# EAGLE design IPSv2.1 (EAGLE 9.5.1)

## Sheet 1 of 3: Circuit principal
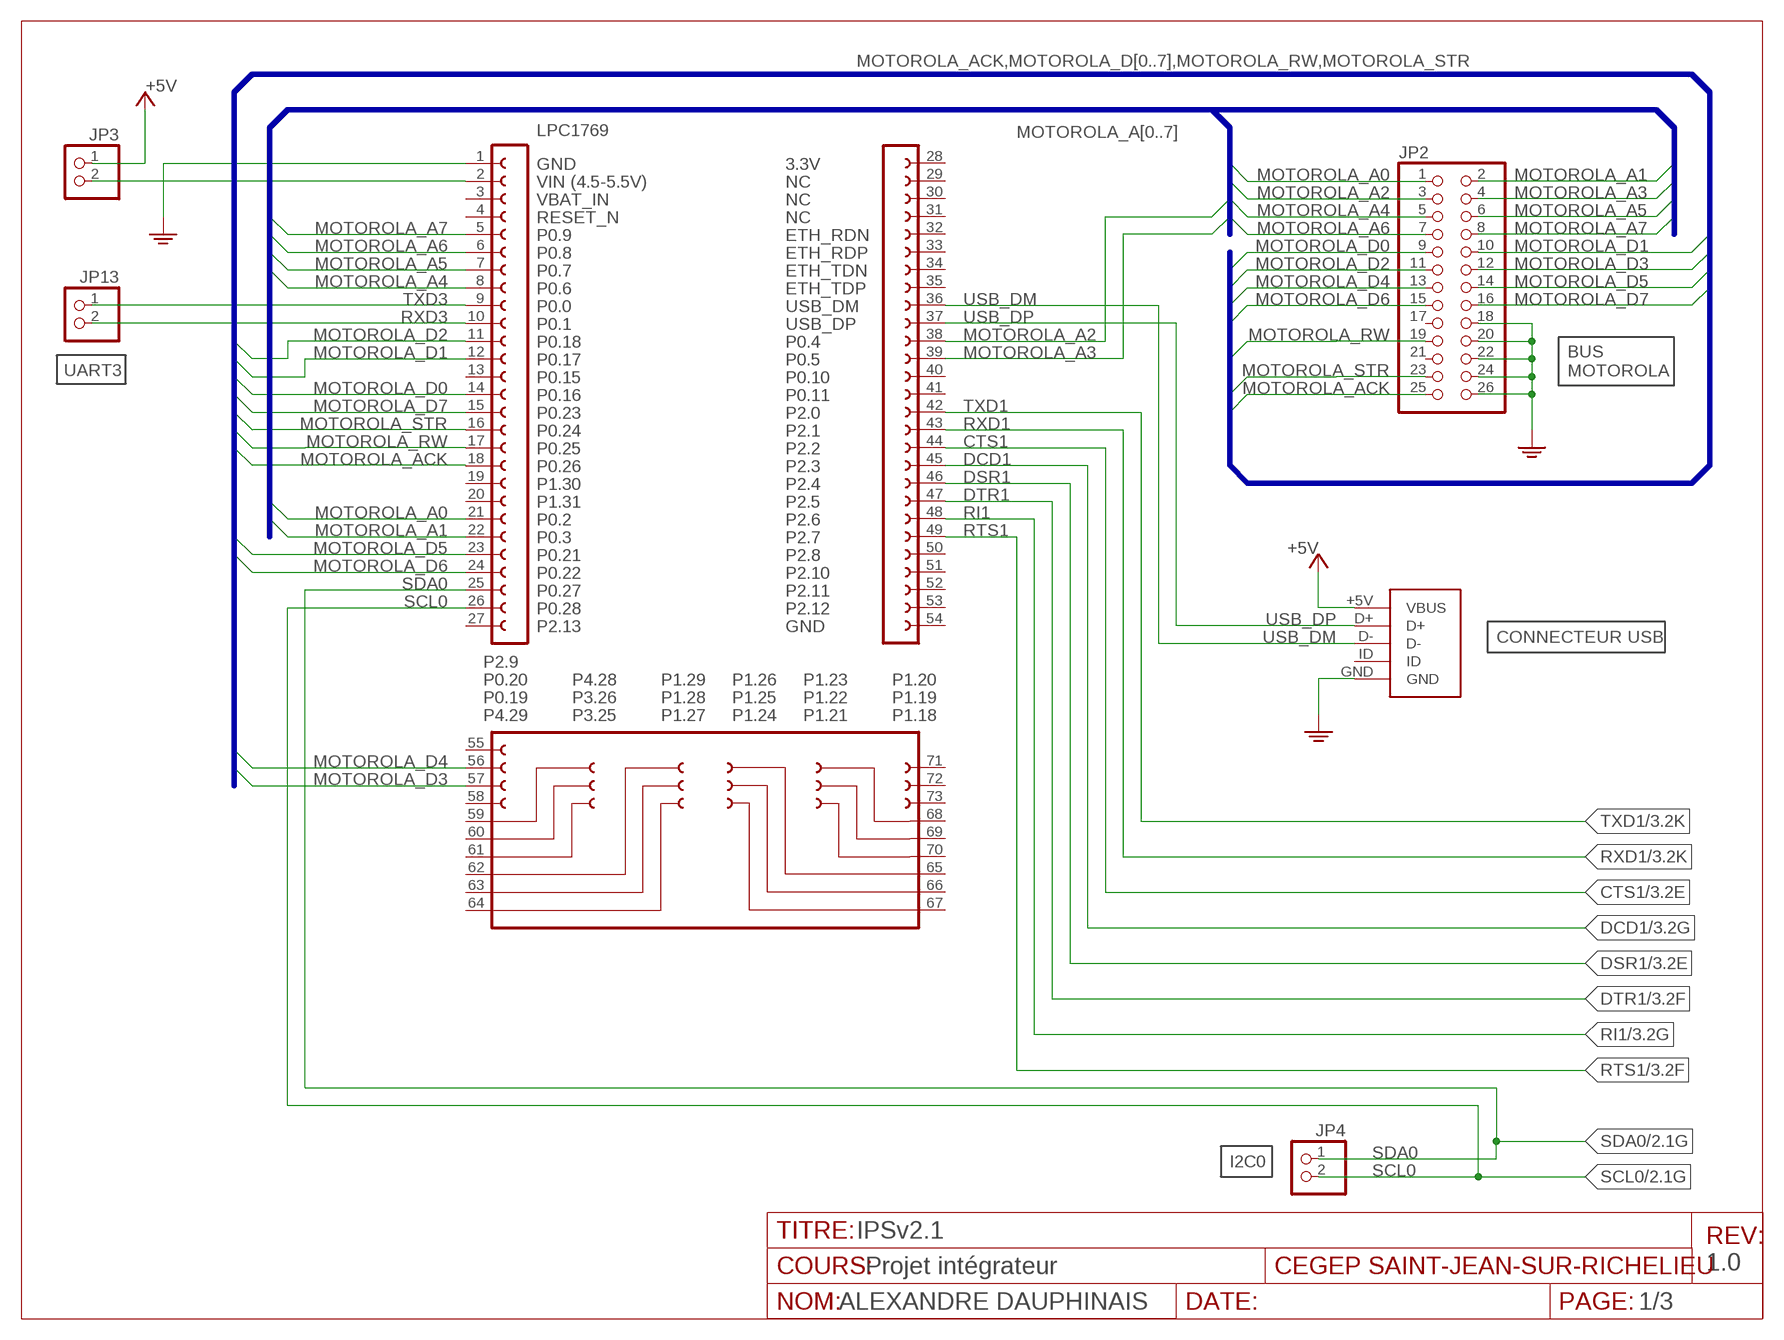
[diagram p0: schematic, sheet 1]

### Parts
JP2  PINHD-2X13  [2X13]
JP3  PINHD-1X2  [1X02]
JP4  PINHD-1X2  [1X02]
JP13  PINHD-1X2  [1X02]
LPC1769  LPCXPRESSO_LPC1769  [LPCXPRESSO_LPC1769]
U$2  USB-MICRO-BREAKOUT  [USB-MICRO-BREAKOUT]

### Nets
+5V: JP3.1 U$2.+5V(VBUS) ; also sheet 2,3
CTS1: LPC1769.44 ; also sheet 3
DCD1: LPC1769.45 ; also sheet 3
DSR1: LPC1769.46 ; also sheet 3
DTR1: LPC1769.47 ; also sheet 3
GND: JP2.18 JP2.20 JP2.22 JP2.24 JP2.26 LPC1769.1 U$2.GND ; also sheet 2,3
MOTOROLA_A0: JP2.1 LPC1769.21
MOTOROLA_A1: JP2.2 LPC1769.22
MOTOROLA_A2: JP2.3 LPC1769.38
MOTOROLA_A3: JP2.4 LPC1769.39
MOTOROLA_A4: JP2.5 LPC1769.8
MOTOROLA_A5: JP2.6 LPC1769.7
MOTOROLA_A6: JP2.7 LPC1769.6
MOTOROLA_A7: JP2.8 LPC1769.5
MOTOROLA_ACK: JP2.25 LPC1769.18
MOTOROLA_D0: JP2.9 LPC1769.14
MOTOROLA_D1: JP2.10 LPC1769.12
MOTOROLA_D2: JP2.11 LPC1769.11
MOTOROLA_D3: JP2.12 LPC1769.57
MOTOROLA_D4: JP2.13 LPC1769.56
MOTOROLA_D5: JP2.14 LPC1769.23
MOTOROLA_D6: JP2.15 LPC1769.24
MOTOROLA_D7: JP2.16 LPC1769.15
MOTOROLA_RW: JP2.19 LPC1769.17
MOTOROLA_STR: JP2.23 LPC1769.16
N$7: JP3.2 LPC1769.2
RI1: LPC1769.48 ; also sheet 3
RTS1: LPC1769.49 ; also sheet 3
RXD1: LPC1769.43 ; also sheet 3
RXD3: JP13.2 LPC1769.10
SCL0: JP4.2 LPC1769.26 ; also sheet 2
SDA0: JP4.1 LPC1769.25 ; also sheet 2
TXD1: LPC1769.42 ; also sheet 3
TXD3: JP13.1 LPC1769.9
USB_DM: LPC1769.36 U$2.D-
USB_DP: LPC1769.37 U$2.D+
Unconnected: JP2.17 JP2.21 LPC1769.3 LPC1769.4 LPC1769.13 LPC1769.19 LPC1769.20 LPC1769.27 LPC1769.28 LPC1769.29 LPC1769.30 LPC1769.31 LPC1769.32 LPC1769.33 LPC1769.34 LPC1769.35 LPC1769.40 LPC1769.41 LPC1769.50 LPC1769.51 LPC1769.52 LPC1769.53 LPC1769.54 LPC1769.55 LPC1769.58 LPC1769.59 LPC1769.60 LPC1769.61 LPC1769.62 LPC1769.63 LPC1769.64 LPC1769.65 LPC1769.66 LPC1769.67 LPC1769.68 LPC1769.69 LPC1769.70 LPC1769.71 LPC1769.72 LPC1769.73 U$2.ID

### Buses
MOTOROLA_A[0..7]
MOTOROLA_ACK,MOTOROLA_D[0..7],MOTOROLA_RW,MOTOROLA_STR

### Notes on the sheet
- UART3
- BUS
  MOTOROLA
- CONNECTEUR USB
- I2C0
- Projet intégrateur

## Sheet 2 of 3: I2C0
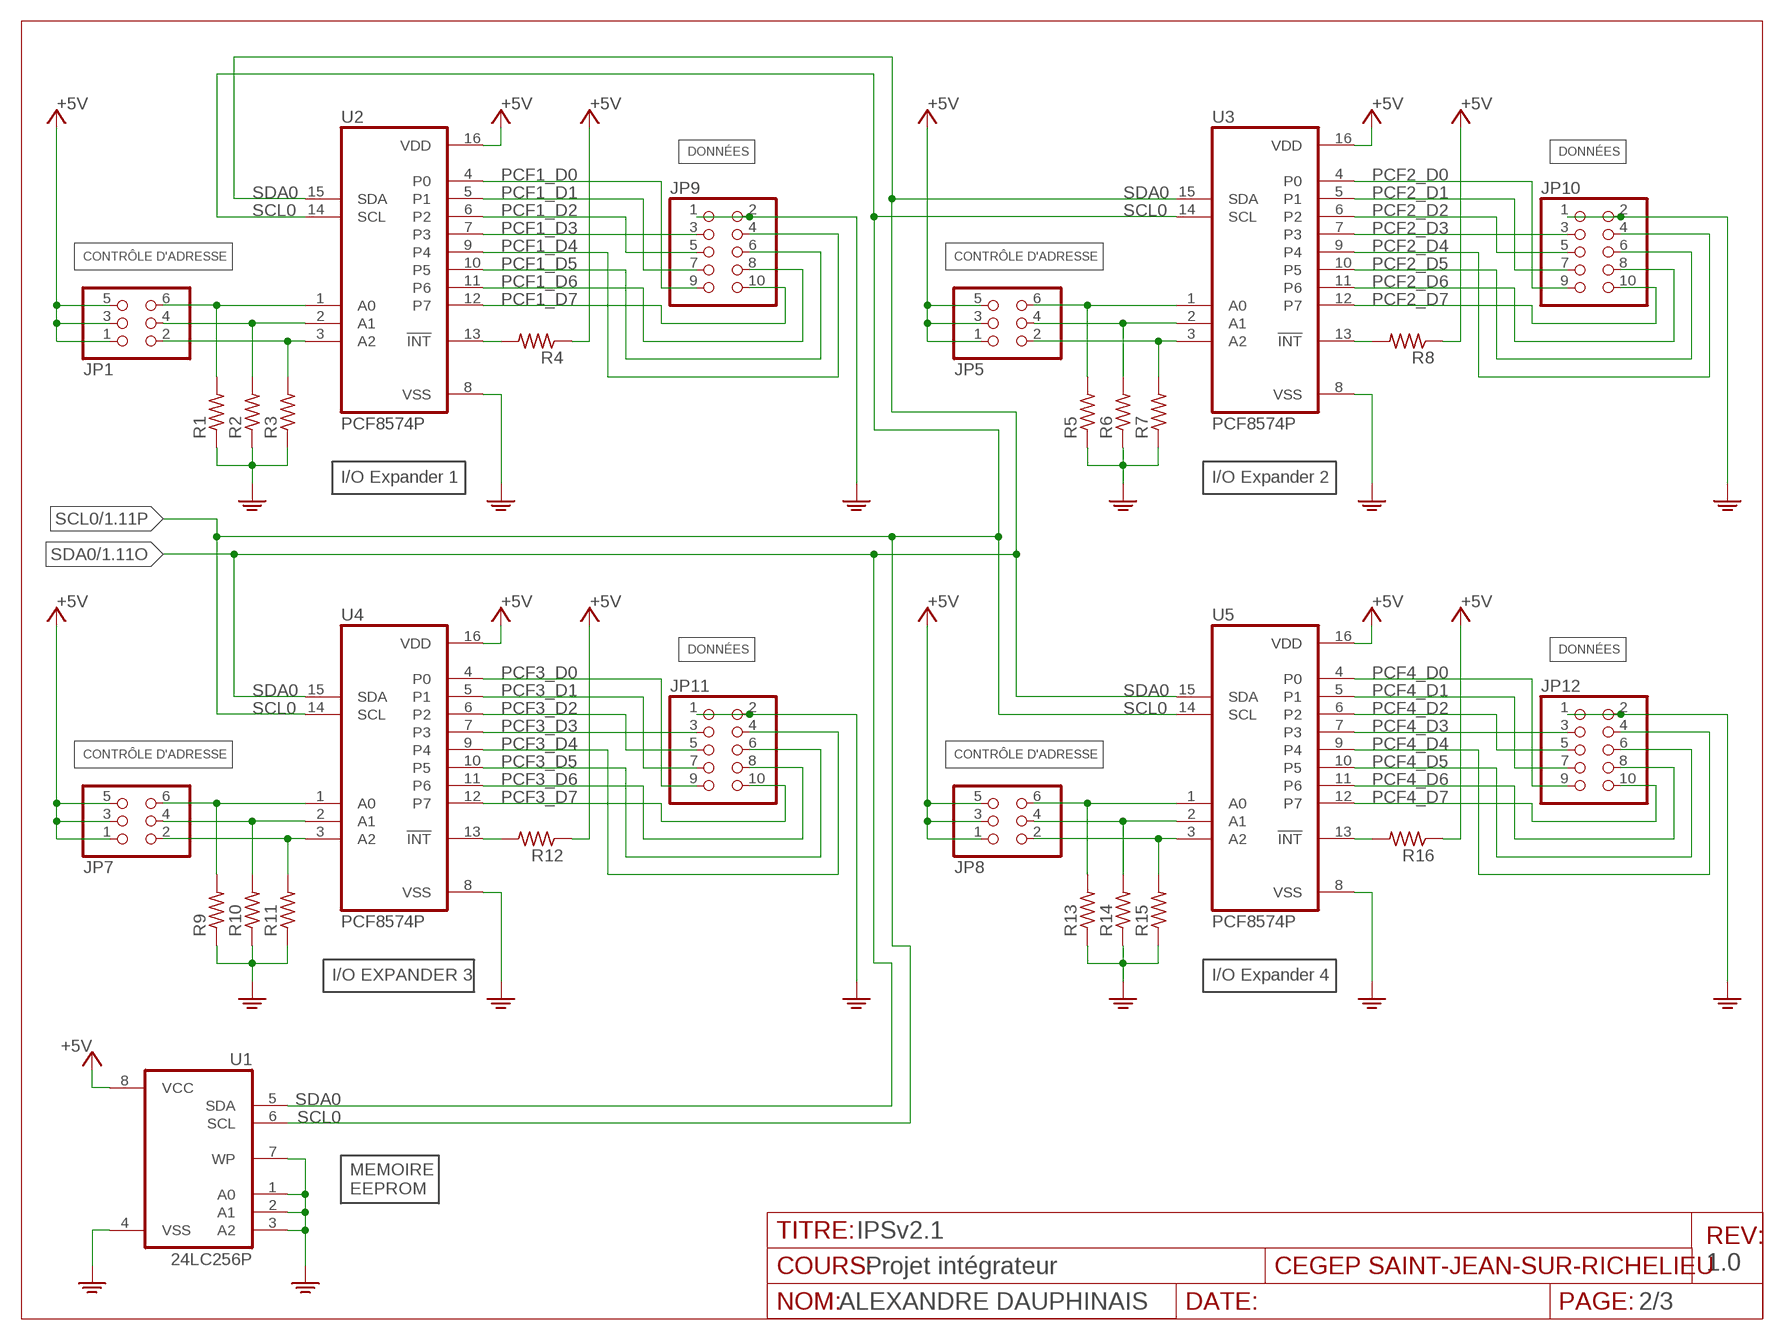
[diagram p1: schematic, sheet 2]

### Parts
JP1  PINHD-2X3  [2X03]
JP5  PINHD-2X3  [2X03]
JP7  PINHD-2X3  [2X03]
JP8  PINHD-2X3  [2X03]
JP9  PINHD-2X5  [2X05]
JP10  PINHD-2X5  [2X05]
JP11  PINHD-2X5  [2X05]
JP12  PINHD-2X5  [2X05]
R1  R-US_M1206  [M1206]
R2  R-US_M1206  [M1206]
R3  R-US_M1206  [M1206]
R4  R-US_M1206  [M1206]
R5  R-US_M1206  [M1206]
R6  R-US_M1206  [M1206]
R7  R-US_M1206  [M1206]
R8  R-US_M1206  [M1206]
R9  R-US_M1206  [M1206]
R10  R-US_M1206  [M1206]
R11  R-US_M1206  [M1206]
R12  R-US_M1206  [M1206]
R13  R-US_M1206  [M1206]
R14  R-US_M1206  [M1206]
R15  R-US_M1206  [M1206]
R16  R-US_M1206  [M1206]
U1  24LC256P  [DIP08]
U2  PCF8574P  [DIP16]
U3  PCF8574P  [DIP16]
U4  PCF8574P  [DIP16]
U5  PCF8574P  [DIP16]

### Nets
+5V: JP1.1 JP1.3 JP1.5 JP5.1 JP5.3 JP5.5 JP7.1 JP7.3 JP7.5 JP8.1 JP8.3 JP8.5 R4.1 R8.1 R12.1 R16.1 U1.8(VCC) U2.16(VDD) U3.16(VDD) U4.16(VDD) U5.16(VDD) ; also sheet 1,3
GND: JP9.1 JP9.2 JP10.1 JP10.2 JP11.1 JP11.2 JP12.1 JP12.2 R1.1 R2.1 R3.1 R5.1 R6.1 R7.1 R9.1 R10.1 R11.1 R13.1 R14.1 R15.1 U1.1(A0) U1.2(A1) U1.3(A2) U1.4(VSS) U1.7(WP) U2.8(VSS) U3.8(VSS) U4.8(VSS) U5.8(VSS) ; also sheet 1,3
N$1: R8.2 U3.13(!INT)
N$3: R12.2 U4.13(!INT)
N$4: R4.2 U2.13(!INT)
N$8: R16.2 U5.13(!INT)
PCF1_A0: JP1.6 R1.2 U2.1(A0)
PCF1_A1: JP1.4 R2.2 U2.2(A1)
PCF1_A2: JP1.2 R3.2 U2.3(A2)
PCF1_D0: JP9.9 U2.4(P0)
PCF1_D1: JP9.7 U2.5(P1)
PCF1_D2: JP9.5 U2.6(P2)
PCF1_D3: JP9.3 U2.7(P3)
PCF1_D4: JP9.4 U2.9(P4)
PCF1_D5: JP9.6 U2.10(P5)
PCF1_D6: JP9.8 U2.11(P6)
PCF1_D7: JP9.10 U2.12(P7)
PCF2_A0: JP5.6 R5.2 U3.1(A0)
PCF2_A1: JP5.4 R6.2 U3.2(A1)
PCF2_A2: JP5.2 R7.2 U3.3(A2)
PCF2_D0: JP10.9 U3.4(P0)
PCF2_D1: JP10.7 U3.5(P1)
PCF2_D2: JP10.5 U3.6(P2)
PCF2_D3: JP10.3 U3.7(P3)
PCF2_D4: JP10.4 U3.9(P4)
PCF2_D5: JP10.6 U3.10(P5)
PCF2_D6: JP10.8 U3.11(P6)
PCF2_D7: JP10.10 U3.12(P7)
PCF3_A0: JP7.6 R9.2 U4.1(A0)
PCF3_A1: JP7.4 R10.2 U4.2(A1)
PCF3_A2: JP7.2 R11.2 U4.3(A2)
PCF3_D0: JP11.9 U4.4(P0)
PCF3_D1: JP11.7 U4.5(P1)
PCF3_D2: JP11.5 U4.6(P2)
PCF3_D3: JP11.3 U4.7(P3)
PCF3_D4: JP11.4 U4.9(P4)
PCF3_D5: JP11.6 U4.10(P5)
PCF3_D6: JP11.8 U4.11(P6)
PCF3_D7: JP11.10 U4.12(P7)
PCF4_A0: JP8.6 R13.2 U5.1(A0)
PCF4_A1: JP8.4 R14.2 U5.2(A1)
PCF4_A2: JP8.2 R15.2 U5.3(A2)
PCF4_D0: JP12.9 U5.4(P0)
PCF4_D1: JP12.7 U5.5(P1)
PCF4_D2: JP12.5 U5.6(P2)
PCF4_D3: JP12.3 U5.7(P3)
PCF4_D4: JP12.4 U5.9(P4)
PCF4_D5: JP12.6 U5.10(P5)
PCF4_D6: JP12.8 U5.11(P6)
PCF4_D7: JP12.10 U5.12(P7)
SCL0: U1.6(SCL) U2.14(SCL) U3.14(SCL) U4.14(SCL) U5.14(SCL) ; also sheet 1
SDA0: U1.5(SDA) U2.15(SDA) U3.15(SDA) U4.15(SDA) U5.15(SDA) ; also sheet 1

### Notes on the sheet
- DONNÉES | DONNÉES
- CONTRÔLE D'ADRESSE | CONTRÔLE D'ADRESSE
- I/O Expander 1 | I/O Expander 2
- DONNÉES | DONNÉES
- CONTRÔLE D'ADRESSE | CONTRÔLE D'ADRESSE
- I/O EXPANDER 3 | I/O Expander 4
- MEMOIRE
  EEPROM
- Projet intégrateur

## Sheet 3 of 3: UART1
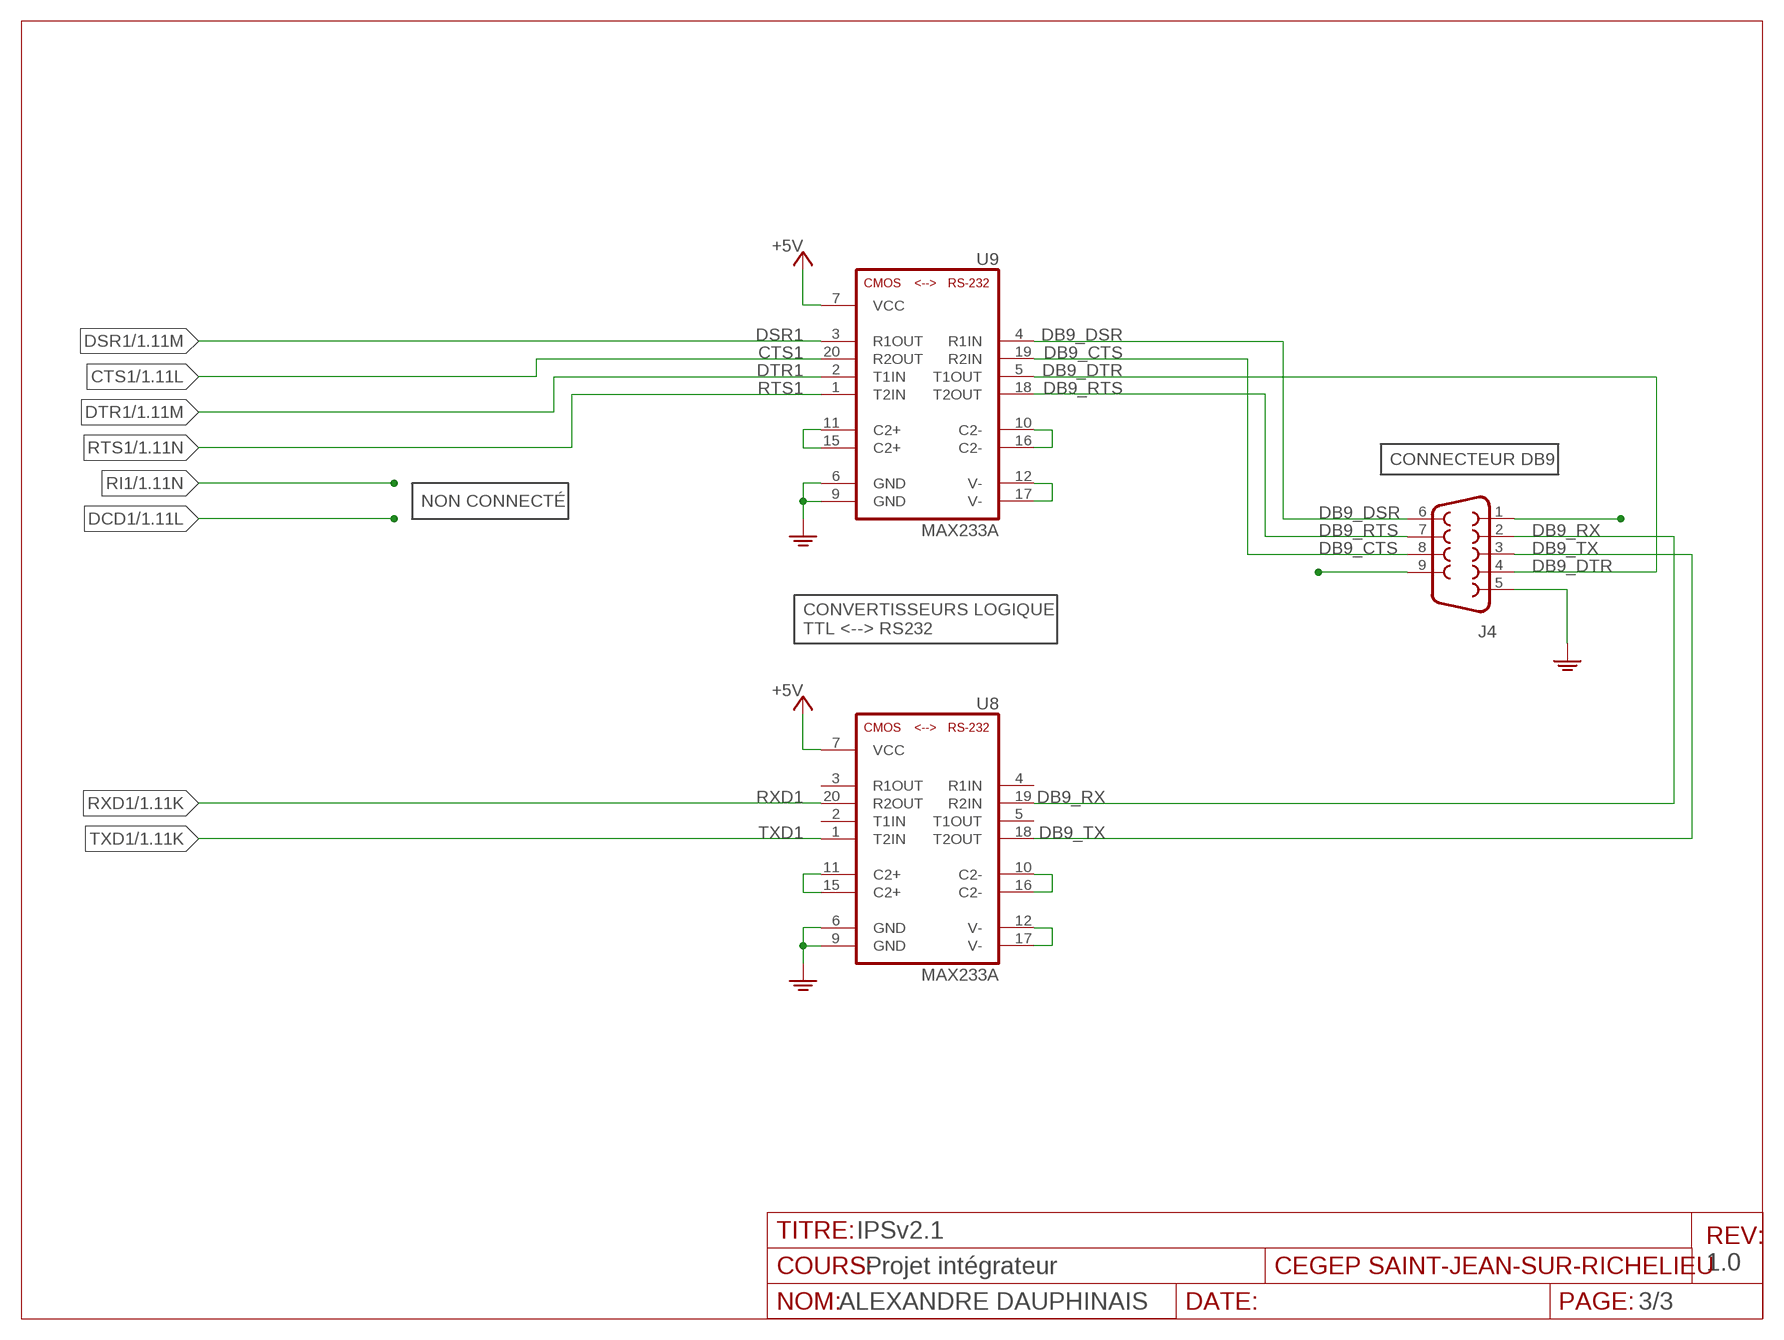
[diagram p2: schematic, sheet 3]

### Parts
J4  DB9FEMALE  [DB9]
U8  MAX233A  MAX233ACPP  [DIP20]
U9  MAX233A  MAX233ACPP  [DIP20]

### Nets
+5V: U8.7(VCC) U9.7(VCC) ; also sheet 1,2
CTS1: U9.20(R2OUT) ; also sheet 1
DB9_CTS: J4.8 U9.19(R2IN)
DB9_DSR: J4.6 U9.4(R1IN)
DB9_DTR: J4.4 U9.5(T1OUT)
DB9_RTS: J4.7 U9.18(T2OUT)
DB9_RX: J4.2 U8.19(R2IN)
DB9_TX: J4.3 U8.18(T2OUT)
DSR1: U9.3(R1OUT) ; also sheet 1
DTR1: U9.2(T1IN) ; also sheet 1
GND: J4.5 U8.6(GND) U8.9(GND) U9.6(GND) U9.9(GND) ; also sheet 1,2
N$2: J4.9
N$5: J4.1
N$9: U8.12(V-) U8.17(V-)
N$13: U8.10(C2-) U8.16(C2-)
N$14: U8.11(C2+) U8.15(C2+)
N$15: U9.12(V-) U9.17(V-)
N$16: U9.10(C2-) U9.16(C2-)
N$17: U9.11(C2+) U9.15(C2+)
RTS1: U9.1(T2IN) ; also sheet 1
RXD1: U8.20(R2OUT) ; also sheet 1
TXD1: U8.1(T2IN) ; also sheet 1
Unconnected: U8.2(T1IN) U8.3(R1OUT) U8.4(R1IN) U8.5(T1OUT)

### Notes on the sheet
- CONNECTEUR DB9
- NON CONNECTÉ
- CONVERTISSEURS LOGIQUE
  TTL <--> RS232
- Projet intégrateur

## Library data of the parts
J4 = 11_CONNECTORS:DB9: DB9 Connector Standard DB9 (D-Sub 9) serial connector. Can be used for CAN bus as well as RS485 and RS232. Footprint production proven. Here is the female version connector we sell at SparkFun: 9 Pin Female Serial Connector - PCB Mount <https://www.sparkfun.com/products/429> (PRT-00429) This connector has been used on the following SparkFun products: SparkFun RS232 Shifter - SMD <https://www.sparkfun.com/products/449> (PRT-00449) SparkFun RS232 Shifter SMD (No DB9) <https://www.sparkfun.com/products/8780> (PRT-08780); PROD_ID: CONN-08194
JP1 JP5 JP7 JP8 = pinhead:PINHD-2X3: PIN HEADER
JP2 = pinhead:PINHD-2X13: PIN HEADER
JP3 JP4 JP13 = pinhead:PINHD-1X2: PIN HEADER
JP9-JP12 = pinhead:PINHD-2X5: PIN HEADER
LPC1769 = LPCXpresso_boards:LPCXPRESSO_LPC1769
R1-R16 = rcl:R-US_: RESISTOR, American symbol; SPICEPREFIX: R
U1 = 00_Actifs:24LC256: EEPROM 32K x 8 avec interface I2C Microchip
U2-U5 = 00_Actifs:PCF8574: Interface parallèle de 8 bits pour entrées/sorties sur bus I2C Philips
U8 U9 = 00_Actifs:MAX233A: Traducteurs de niveau 2x RS-232 à TTL/CMOS et 2x TTL/CMOS à RS-232 à alimentation unique +5V Maxim
U$2 = 11_CONNECTORS:USB-MICRO-BREAKOUT

## Board
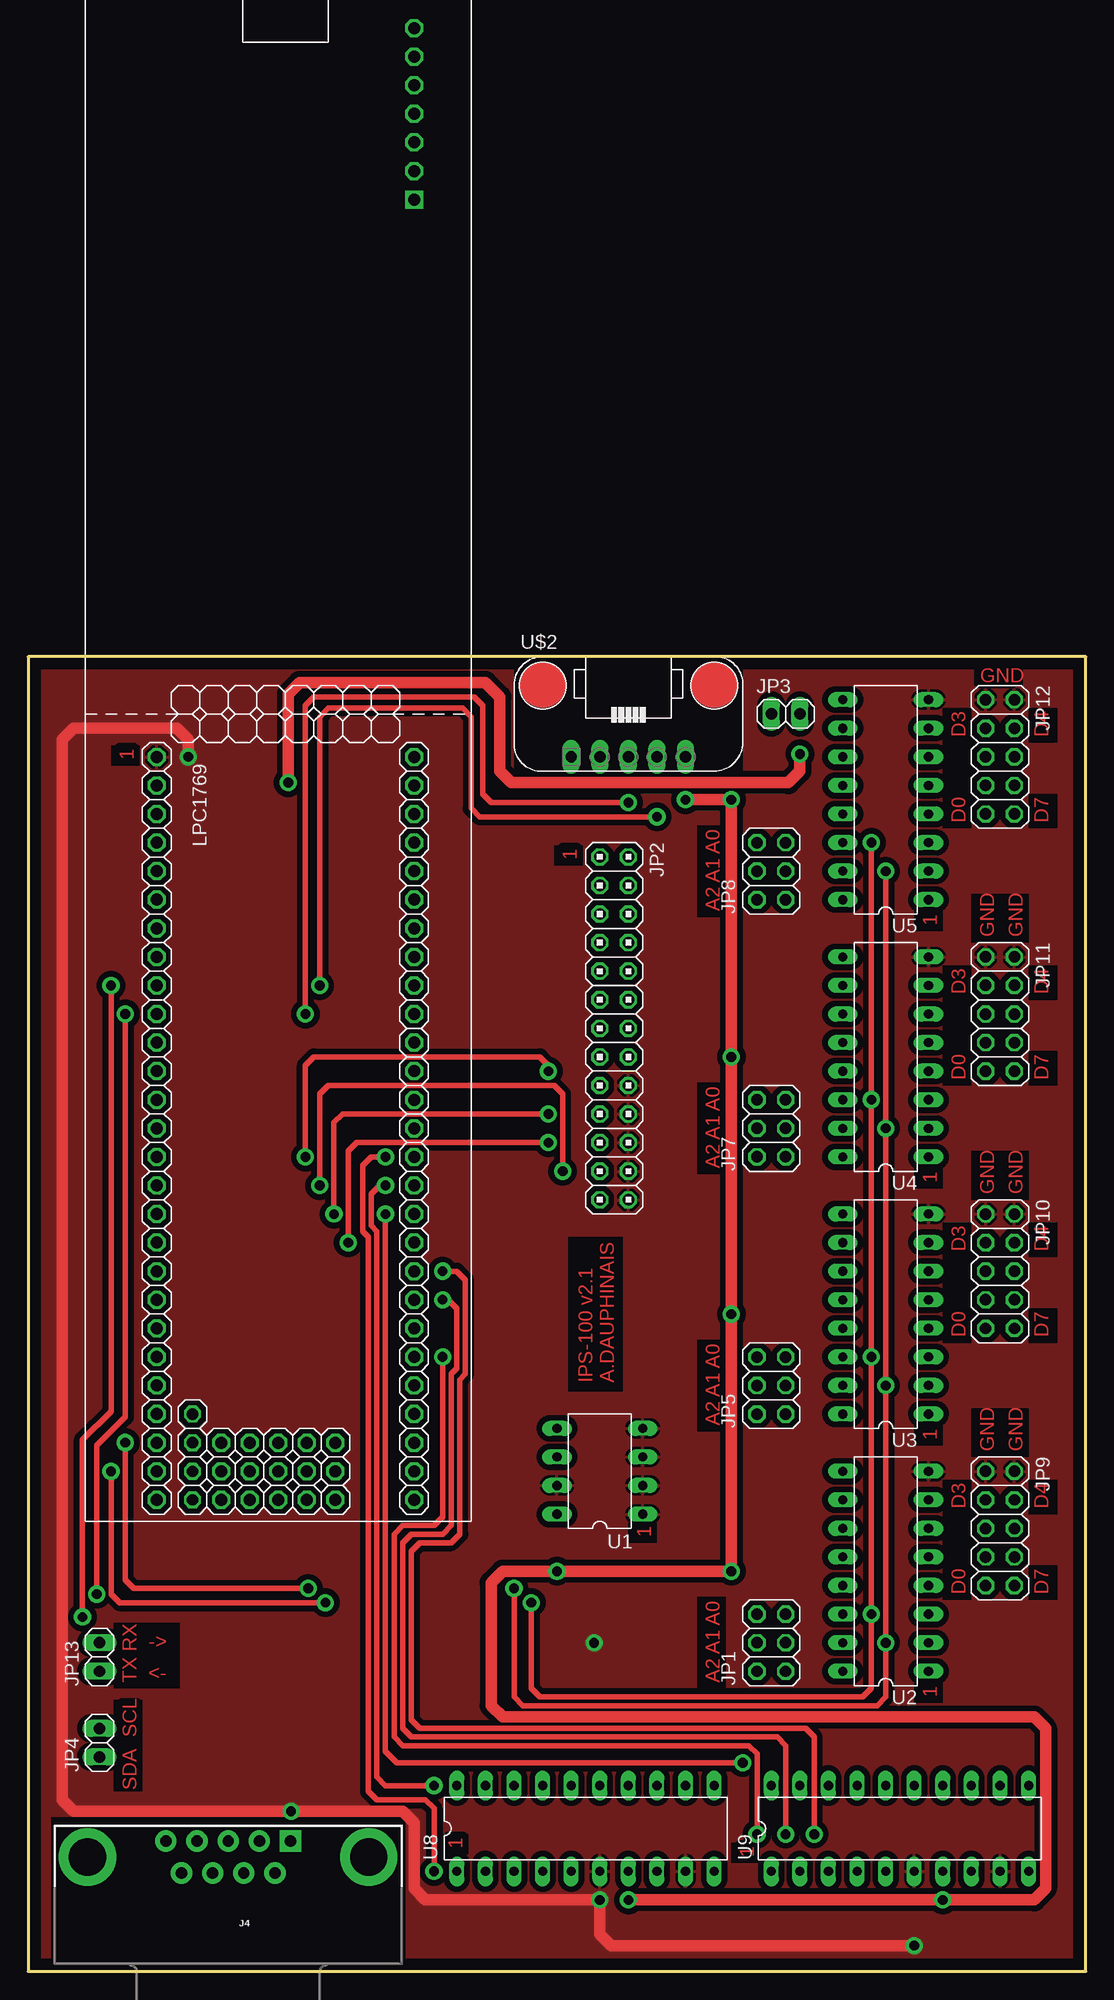
[diagram p3: board, top side]
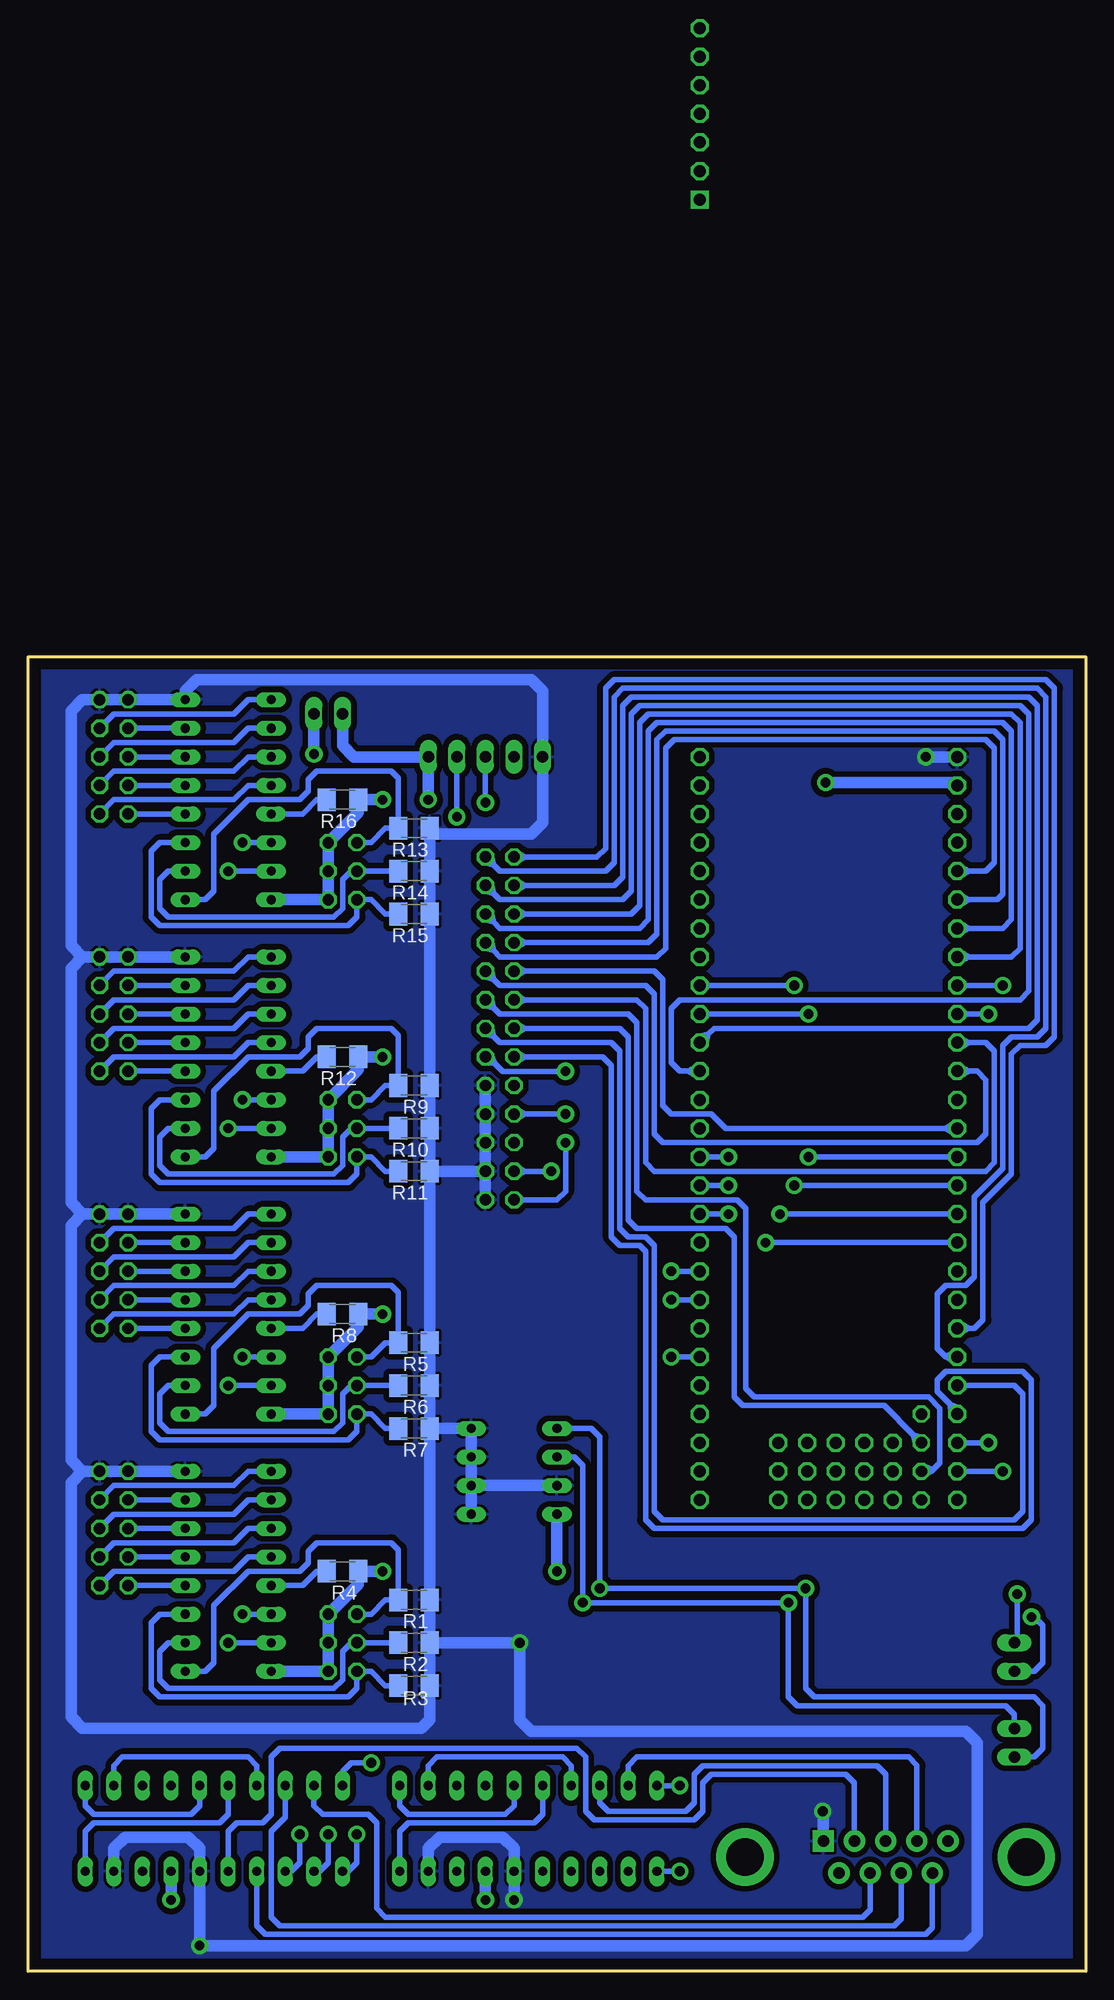
[diagram p4: board, bottom side, seen from below]

Size 93.98 x 116.84 mm. Coordinates in mm from the lower left corner, seen from the top.
Outline: 0,0 93.98,0 93.98,116.84 0,116.84 0,0
Copper layers (1*16): Top 0.035mm / dielectric 1.5mm / Bottom 0.035mm
Design rules "DRCmasse": minimum track width 20mil, minimum drill 1mil, track to track 20mil, track to pad 50mil, pad to pad 10mil, via to via 10mil, smd to smd 8mil, copper to edge 40mil, drill to drill 8mil, minimum pad ring 10mil, minimum via ring 8mil, stop-mask expansion 0mil, vias tented up to drill 0mil, thermal gap 10mil
tRestrict: area 7.4,107.2 to 9.9,109; area 46.7,98.3 to 49.3,100.1; area 78.7,92.5 to 81.3,94.2; area 78.7,69.6 to 81.3,71.4; area 78.7,46.7 to 81.3,48.5; area 78.7,23.9 to 81.3,25.7; area 62.5,9.7 to 65,11.4; area 36.6,10.4 to 39.1,12.2; area 81.3,33 to 83.8,43.7; area 88.9,33 to 91.4,36.1; area 88.9,40.6 to 91.4,43.7; area 83.8,45.7 to 88.9,50; 23 more areas

### Footprints (pad centres in the part's own frame; a part is rotated, then mirrored left to right if it is on the bottom)
DB9 = drill 1.016 pad 1.88: 1 5.54,-1.42; 2 2.77,-1.42; 3 0,-1.42; 4 -2.77,-1.42; 6 4.15,1.42; 7 1.38,1.42; 8 -1.38,1.42; 9 -4.15,1.42 | drill 1.016 pad 1.88 square: 5 -5.54,-1.42 | drill 3.302 pad 5.08: G1 -12.5,0; G2 12.5,0
2X03 = drill 1.016 octagon: 1 -2.54,-1.27; 2 -2.54,1.27; 3 0,-1.27; 4 0,1.27; 5 2.54,-1.27; 6 2.54,1.27
2X13 = drill 1.016 octagon: 1 -15.24,-1.27; 2 -15.24,1.27; 3 -12.7,-1.27; 4 -12.7,1.27; 5 -10.16,-1.27; 6 -10.16,1.27; 7 -7.62,-1.27; 8 -7.62,1.27; 9 -5.08,-1.27; 10 -5.08,1.27; 11 -2.54,-1.27; 12 -2.54,1.27; 13 0,-1.27; 14 0,1.27; 15 2.54,-1.27; 16 2.54,1.27; 17 5.08,-1.27; 18 5.08,1.27; 19 7.62,-1.27; 20 7.62,1.27; 21 10.16,-1.27; 22 10.16,1.27; 23 12.7,-1.27; 24 12.7,1.27; 25 15.24,-1.27; 26 15.24,1.27
1X02 = drill 1.016 long: 1 -1.27,0; 2 1.27,0
2X05 = drill 1.016 octagon: 1 -5.08,-1.27; 2 -5.08,1.27; 3 -2.54,-1.27; 4 -2.54,1.27; 5 0,-1.27; 6 0,1.27; 7 2.54,-1.27; 8 2.54,1.27; 9 5.08,-1.27; 10 5.08,1.27
LPCXPRESSO_LPC1769 = drill 1.067 octagon: 1 33.655,-5.715; 2 36.195,-5.715; 3 38.735,-5.715; 4 41.275,-5.715; 5 43.815,-5.715; 6 46.355,-5.715; 7 48.895,-5.715; 8 51.435,-5.715; 9 53.975,-5.715; 10 56.515,-5.715; 11 59.055,-5.715; 12 61.595,-5.715; 13 64.135,-5.715; 14 66.675,-5.715; 15 69.215,-5.715; 16 71.755,-5.715; 17 74.295,-5.715; 18 76.835,-5.715; 19 79.375,-5.715; 20 81.915,-5.715; 21 84.455,-5.715; 22 86.995,-5.715; 23 89.535,-5.715; 24 92.075,-5.715; 25 94.615,-5.715; 26 97.155,-5.715; 27 99.695,-5.715; 28 33.655,17.145; 29 36.195,17.145; 30 38.735,17.145; 31 41.275,17.145; 32 43.815,17.145; 33 46.355,17.145; 34 48.895,17.145; 35 51.435,17.145; 36 53.975,17.145; 37 56.515,17.145; 38 59.055,17.145; 39 61.595,17.145; 40 64.135,17.145; 41 66.675,17.145; 42 69.215,17.145; 43 71.755,17.145; 44 74.295,17.145; 45 76.835,17.145; 46 79.375,17.145; 47 81.915,17.145; 48 84.455,17.145; 49 86.995,17.145; 50 89.535,17.145; 51 92.075,17.145; 52 94.615,17.145; 53 97.155,17.145; 54 99.695,17.145; 59 94.615,0; 60 97.155,0; 61 99.695,0; 62 94.615,2.54; 63 97.155,2.54; 64 99.695,2.54; 65 94.615,5.08; 66 97.155,5.08; 67 99.695,5.08; 68 94.615,7.62; 69 97.155,7.62; 70 99.695,7.62; 71 94.615,10.16; 72 97.155,10.16; 73 99.695,10.16; P$1 -31.115,17.145; P$2 -28.575,17.145; P$3 -26.035,17.145; P$4 -23.495,17.145; P$5 -20.955,17.145; P$6 -18.415,17.145 | drill 1 octagon: 55 92.075,-2.54; 56 94.615,-2.54; 57 97.155,-2.54; 58 99.695,-2.54 | drill 1.067 square: P$7 -15.875,17.145
M1206 = smd 1.6 x 2: 1 -1.4,0; 2 1.4,0
DIP08 = drill 0.813 long: 1 -3.81,-3.81; 2 -1.27,-3.81; 3 1.27,-3.81; 4 3.81,-3.81; 5 3.81,3.81; 6 1.27,3.81; 7 -1.27,3.81; 8 -3.81,3.81
DIP16 = drill 0.813 long: 1 -8.89,-3.81; 2 -6.35,-3.81; 3 -3.81,-3.81; 4 -1.27,-3.81; 5 1.27,-3.81; 6 3.81,-3.81; 7 6.35,-3.81; 8 8.89,-3.81; 9 8.89,3.81; 10 6.35,3.81; 11 3.81,3.81; 12 1.27,3.81; 13 -1.27,3.81; 14 -3.81,3.81; 15 -6.35,3.81; 16 -8.89,3.81
DIP20 = drill 0.813 long: 1 -11.43,-3.81; 2 -8.89,-3.81; 3 -6.35,-3.81; 4 -3.81,-3.81; 5 -1.27,-3.81; 6 1.27,-3.81; 7 3.81,-3.81; 8 6.35,-3.81; 9 8.89,-3.81; 10 11.43,-3.81; 11 11.43,3.81; 12 8.89,3.81; 13 6.35,3.81; 14 3.81,3.81; 15 1.27,3.81; 16 -1.27,3.81; 17 -3.81,3.81; 18 -6.35,3.81; 19 -8.89,3.81; 20 -11.43,3.81
USB-MICRO-BREAKOUT = drill 1.016 long: +5V 5.08,0; D+ 0,0; D- 2.54,0; GND -5.08,0; ID -2.54,0

### Placement (x,y rotation side)
J4  17.78,10.16 180 top
JP1  66.04,29.21 90 top
JP2  52.07,83.82 270 top
JP3  67.31,111.76 0 top
JP4  6.35,20.32 90 top
JP5  66.04,52.07 90 top
JP7  66.04,74.93 90 top
JP8  66.04,97.79 90 top
JP9  86.36,39.37 270 top
JP10  86.36,62.23 270 top
JP11  86.36,85.09 270 top
JP12  86.36,107.95 270 top
JP13  6.35,27.94 90 top
LPC1769  17.14,141.6 270 top
R1  59.69,33.02 180 bottom
R2  59.69,29.21 180 bottom
R3  59.69,25.4 180 bottom
R4  66.04,35.56 180 bottom
R5  59.69,55.88 180 bottom
R6  59.69,52.07 180 bottom
R7  59.69,48.26 180 bottom
R8  66.04,58.42 180 bottom
R9  59.69,78.74 180 bottom
R10  59.69,74.93 180 bottom
R11  59.69,71.12 180 bottom
R12  66.04,81.28 180 bottom
R13  59.69,101.6 180 bottom
R14  59.69,97.79 180 bottom
R15  59.69,93.98 180 bottom
R16  66.04,104.14 180 bottom
U1  50.8,44.45 90 top
U2  76.2,35.56 90 top
U3  76.2,58.42 90 top
U4  76.2,81.28 90 top
U5  76.2,104.14 90 top
U8  49.53,12.7 0 top
U9  77.47,12.7 0 top
U$2  53.34,107.95 0 top

### Tracks (layer width: path | path; a pad name or v marks a point on that pad's centre or on a via)
+5V  (via drill 0.86 pad 1.52)
  Top 1.016: v53.34,6.35 v81.28,6.35 89.41,6.35 90.42,7.37 90.42,21.59 89.41,22.61 42.16,22.61 41.15,23.62 41.15,34.54 42.16,35.56 v46.99,35.56 v62.48,35.56 v62.48,58.42 v62.48,81.28 v62.48,104.14 v58.42,104.14
  Bottom 1.016: U2.16 JP1.1 JP1.3 JP1.5 64.64,34.42 R4.1 v62.48,35.56 | U5.16 JP8.1 JP8.3 JP8.5 64.64,103 R16.1 v62.48,104.14 | U4.16 JP7.1 JP7.3 JP7.5 64.64,80.14 R12.1 v62.48,81.28 | U3.16 JP5.1 JP5.3 JP5.5 64.64,57.28 R8.1 v62.48,58.42 | U1.8 v46.99,35.56 | U9.7 v81.28,6.35 | v53.34,6.35 U8.7 | v58.42,104.14 U$2.+5V 65.02,107.95 66.04,108.97 JP3.1
CTS1  (via drill 0.86 pad 1.52)
  Top 0.508: v31.75,67.31 31.75,19.56 32.77,18.54 v63.5,18.54
  Bottom 0.508: LPC1769.44 v31.75,67.31 | v63.5,18.54 65.28,18.54 66.04,17.78 U9.20
DB9_CTS
  Bottom 0.508: J4.8 19.16,5.48 19.81,4.83 62.23,4.83 62.99,5.59 62.99,13.21 63.75,13.97 67.82,13.97 68.58,14.73 U9.19
DB9_DSR
  Bottom 0.508: U9.4 73.66,4.06 72.9,3.3 14.22,3.3 13.63,3.9 J4.6
DB9_DTR
  Bottom 0.508: J4.4 20.55,16.74 21.34,17.53 33.27,17.53 34.04,16.76 34.04,14.22 34.8,13.46 43.69,13.46 44.45,14.22 44.45,19.05 45.21,19.81 71.63,19.81 72.39,19.05 72.39,13.97 73.15,13.21 75.44,13.21 76.2,12.45 U9.5
DB9_RTS
  Bottom 0.508: J4.7 16.4,4.68 17.02,4.06 71.63,4.06 72.39,4.83 72.39,12.45 71.12,13.72 U9.18
DB9_RX
  Bottom 0.508: J4.2 15.01,18.31 15.75,19.05 39.88,19.05 40.64,18.29 U8.19
DB9_TX
  Bottom 0.508: J4.3 17.78,17.53 18.54,18.29 34.04,18.29 34.8,17.53 34.8,14.99 35.56,14.22 42.42,14.22 43.18,14.99 U8.18
DSR1  (via drill 0.86 pad 1.52)
  Top 0.508: v36.83,62.23 38.1,62.23 38.86,61.47 38.86,53.09 38.35,52.58 38.35,38.86 37.59,38.1 34.8,38.1 34.04,37.34 34.04,22.35 34.8,21.59 69.09,21.59 69.85,20.83 v69.85,12.19
  Bottom 0.508: LPC1769.46 v36.83,62.23 | v69.85,12.19 69.85,9.65 70.61,8.89 U9.3
DTR1  (via drill 0.86 pad 1.52)
  Top 0.508: v36.83,59.69 37.34,59.69 38.1,58.93 38.1,53.59 37.59,53.09 37.59,39.62 36.83,38.86 34.04,38.86 33.27,38.1 33.27,21.59 34.04,20.83 66.55,20.83 67.31,20.07 v67.31,12.19
  Bottom 0.508: LPC1769.47 v36.83,59.69 | v67.31,12.19 67.31,9.65 68.07,8.89 U9.2
GND  (via drill 0.86 pad 1.52)
  Top 1.016: v14.22,107.95 14.22,109.47 13.21,110.49 4.06,110.49 3.05,109.47 3.05,15.24 4.06,14.22 v23.37,14.22 33.27,14.22 34.29,13.21 34.29,7.37 35.31,6.35 v50.8,6.35 50.8,3.3 51.82,2.29 v78.74,2.29
  Bottom 1.016: JP2.24 JP2.22 JP2.20 JP2.18 | JP2.24 JP2.26 | U1.1 U1.2 | U1.2 U1.3 U1.4 58.04,48.26 58.17,48.14 R7.1 | U1.2 U1.7 | LPC1769.1 v14.22,107.95 | R11.1 R10.1 R9.1 R15.1 R14.1 R13.1 57.78,101.09 49.28,101.09 48.26,102.11 U$2.GND 48.26,113.79 49.28,114.81 78.99,114.81 80.01,113.79 U5.8 JP12.1 JP12.2 89.15,113.03 90.17,112.01 90.17,91.19 89.15,90.17 | R7.1 R6.1 R5.1 R11.1 | R2.1 R1.1 R7.1 | R2.1 R3.1 58.29,22.35 59.05,21.59 89.15,21.59 90.17,22.61 90.17,43.43 89.15,44.45 | R11.1 58.17,71 58.04,71.12 JP2.24 | U2.8 JP9.1 JP9.2 89.15,44.45 | U3.8 JP10.1 JP10.2 89.15,67.31 | U4.8 JP11.1 JP11.2 89.15,90.17 | 89.15,90.17 90.17,89.15 90.17,68.33 89.15,67.31 | 89.15,67.31 90.17,66.29 90.17,45.47 89.15,44.45 | R2.1 v50.29,29.21 50.29,22.35 49.28,21.34 10.67,21.34 9.65,20.32 9.65,3.3 10.67,2.29 v78.74,2.29 U9.6 78.74,10.92 79.76,11.94 85.34,11.94 86.36,10.92 U9.9 | J4.5 23.32,14.18 v23.37,14.22 | v50.8,6.35 U8.6 50.8,10.92 51.82,11.94 57.4,11.94 58.42,10.92 U8.9
  pour Top: 0,0 93.98,0 93.98,116.84 0,116.84
  pour Bottom: 0,0 93.98,0 93.98,116.84 0,116.84
MOTOROLA_A0
  Bottom 0.508: 49.78,99.06 JP2.1 | 10.36,57.15 9.91,57.15 9.14,57.91 9.14,68.33 6.6,70.87 6.6,81.53 5.84,82.3 3.56,82.3 2.79,83.06 2.79,114.05 3.56,114.81 41.91,114.81 42.67,114.05 42.67,99.82 43.43,99.06 49.78,99.06 | 10.36,57.15 | 10.36,57.15 LPC1769.21 | 49.78,99.06 | 49.78,99.06 50.55,98.62 | JP2.1 50.55,98.62 | 49.78,99.06 | 49.78,99.06 50.55,99.5 | JP2.1 50.55,99.5 | 49.78,99.06 50.55,98.62 | 50.55,98.62 | JP2.1 50.55,98.62 | 49.78,99.06 50.55,99.5 | JP2.1 50.55,99.5 | 49.78,99.06 50.55,98.62 | JP2.1 50.55,98.62 | 49.78,99.06 50.55,99.5 | JP2.1 50.55,99.5 | 10.36,57.15 | 10.36,57.15 11.15,56.68 | LPC1769.21 11.15,56.68 | 10.36,57.15 11.15,57.62 | LPC1769.21 11.15,57.62 | 10.36,57.15 11.15,56.68 | 10.36,57.15 11.15,57.62 | 10.36,57.15 11.15,56.68 | LPC1769.21 11.15,56.68 | 10.36,57.15 11.15,57.62 | LPC1769.21 11.15,57.62
MOTOROLA_A1
  Bottom 0.508: JP2.2 52.62,98.34 | 52.62,98.34 52.07,97.79 42.67,97.79 41.91,98.55 41.91,113.28 41.15,114.05 4.32,114.05 3.56,113.28 3.56,83.82 4.32,83.06 6.6,83.06 7.37,82.3 7.37,71.37 9.91,68.83 9.91,61.72 10.67,60.96 12.45,60.96 13.21,60.2 13.21,55.37 12.5,54.66 | LPC1769.22 12.45,54.61 12.5,54.66 | 12.5,54.66 11.69,55.09 LPC1769.22 | 12.5,54.66 11.73,54.15 LPC1769.22 | 52.62,98.34 53.47,98.57 JP2.2 | 52.62,98.34 52.85,99.19 JP2.2
MOTOROLA_A2
  Bottom 0.508: JP2.3 49.78,96.52 | 33.54,83.3 33.02,83.82 5.08,83.82 4.32,84.58 4.32,112.52 5.08,113.28 40.39,113.28 41.15,112.52 41.15,97.28 41.91,96.52 49.78,96.52 | 33.54,83.3 | 33.54,83.3 LPC1769.38 | 49.78,96.52 | 49.78,96.52 50.55,96.08 | JP2.3 50.55,96.08 | 49.78,96.52 | 49.78,96.52 50.55,96.96 | JP2.3 50.55,96.96 | 49.78,96.52 50.55,96.08 | 50.55,96.08 | JP2.3 50.55,96.08 | 49.78,96.52 50.55,96.96 | JP2.3 50.55,96.96 | 49.78,96.52 50.55,96.08 | JP2.3 50.55,96.08 | 49.78,96.52 50.55,96.96 | JP2.3 50.55,96.96 | 33.54,83.3 | 33.54,83.3 33.76,82.42 | 33.76,82.42 | 33.54,83.3 34.42,83.08 | 34.42,83.08 | 33.54,83.3 33.76,82.42 | 33.76,82.42 | LPC1769.38 33.76,82.42 | 33.54,83.3 | 33.54,83.3 34.42,83.08 | LPC1769.38 34.42,83.08 | 33.54,83.3 33.76,82.42 | LPC1769.38 33.76,82.42 | 33.54,83.3 34.42,83.08 | LPC1769.38 34.42,83.08
MOTOROLA_A3
  Bottom 0.508: JP2.4 52.62,95.8 | 52.62,95.8 52.07,95.25 41.15,95.25 40.39,96.01 40.39,111.76 39.62,112.52 5.84,112.52 5.08,111.76 5.08,87.12 5.84,86.36 36.07,86.36 36.83,85.6 36.83,80.77 36.07,80.01 35.36,80.01 | LPC1769.39 35.36,80.01 | 35.36,80.01 | 35.36,80.01 34.57,80.48 | LPC1769.39 34.57,80.48 | 35.36,80.01 | 35.36,80.01 34.57,79.54 | LPC1769.39 34.57,79.54 | 35.36,80.01 34.57,80.48 | 35.36,80.01 34.57,79.54 | 35.36,80.01 34.57,80.48 | LPC1769.39 34.57,80.48 | 35.36,80.01 34.57,79.54 | LPC1769.39 34.57,79.54 | 52.62,95.8 53.47,96.03 JP2.4 | 52.62,95.8 52.85,96.65 JP2.4
MOTOROLA_A4
  Bottom 0.508: JP2.5 49.78,93.98 | 10.36,90.17 6.6,90.17 5.84,90.93 5.84,111 6.6,111.76 38.86,111.76 39.62,111 39.62,94.74 40.39,93.98 49.78,93.98 | 10.36,90.17 | 10.36,90.17 LPC1769.8 | 49.78,93.98 | 49.78,93.98 50.55,93.54 | JP2.5 50.55,93.54 | 49.78,93.98 | 49.78,93.98 50.55,94.42 | JP2.5 50.55,94.42 | 49.78,93.98 50.55,93.54 | 50.55,93.54 | JP2.5 50.55,93.54 | 49.78,93.98 50.55,94.42 | JP2.5 50.55,94.42 | 49.78,93.98 50.55,93.54 | JP2.5 50.55,93.54 | 49.78,93.98 50.55,94.42 | JP2.5 50.55,94.42 | 10.36,90.17 | 10.36,90.17 11.15,89.7 | LPC1769.8 11.15,89.7 | 10.36,90.17 11.15,90.64 | LPC1769.8 11.15,90.64 | 10.36,90.17 11.15,89.7 | 10.36,90.17 11.15,90.64 | 10.36,90.17 11.15,89.7 | LPC1769.8 11.15,89.7 | 10.36,90.17 11.15,90.64 | LPC1769.8 11.15,90.64
MOTOROLA_A5
  Bottom 0.508: JP2.6 52.62,93.26 | 52.62,93.26 52.07,92.71 39.62,92.71 38.86,93.47 38.86,110.24 38.1,111 7.37,111 6.6,110.24 6.6,93.47 7.37,92.71 10.36,92.71 | 10.36,92.71 | 10.36,92.71 LPC1769.7 | 52.62,93.26 53.47,93.49 JP2.6 | 52.62,93.26 52.85,94.11 JP2.6 | 10.36,92.71 | 10.36,92.71 11.15,92.24 | LPC1769.7 11.15,92.24 | 10.36,92.71 11.15,93.18 | LPC1769.7 11.15,93.18 | 10.36,92.71 11.15,92.24 | 10.36,92.71 11.15,93.18 | 10.36,92.71 11.15,92.24 | LPC1769.7 11.15,92.24 | 10.36,92.71 11.15,93.18 | LPC1769.7 11.15,93.18
MOTOROLA_A6
  Bottom 0.508: JP2.7 49.78,91.44 | LPC1769.6 10.36,95.25 | 10.36,95.25 | 10.36,95.25 7.87,95.25 7.37,95.76 7.37,109.47 8.13,110.24 37.34,110.24 38.1,109.47 38.1,92.2 38.86,91.44 49.78,91.44 | 49.78,91.44 | 49.78,91.44 50.55,91 | JP2.7 50.55,91 | 49.78,91.44 | 49.78,91.44 50.55,91.88 | JP2.7 50.55,91.88 | 49.78,91.44 50.55,91 | 50.55,91 | JP2.7 50.55,91 | 49.78,91.44 50.55,91.88 | JP2.7 50.55,91.88 | 49.78,91.44 50.55,91 | JP2.7 50.55,91 | 49.78,91.44 50.55,91.88 | JP2.7 50.55,91.88 | 10.36,95.25 | 10.36,95.25 11.15,94.78 | LPC1769.6 11.15,94.78 | 10.36,95.25 11.15,95.72 | LPC1769.6 11.15,95.72 | 10.36,95.25 11.15,94.78 | 10.36,95.25 11.15,95.72 | 10.36,95.25 11.15,94.78 | LPC1769.6 11.15,94.78 | 10.36,95.25 11.15,95.72 | LPC1769.6 11.15,95.72
MOTOROLA_A7
  Bottom 0.508: JP2.8 52.62,90.72 | 52.62,90.72 52.07,90.17 38.1,90.17 37.34,90.93 37.34,108.71 36.58,109.47 8.89,109.47 8.13,108.71 8.13,98.55 8.89,97.79 10.36,97.79 | 10.36,97.79 | 10.36,97.79 LPC1769.5 | 52.62,90.72 53.47,90.95 JP2.8 | 52.62,90.72 52.85,91.57 JP2.8 | 10.36,97.79 | 10.36,97.79 11.15,97.32 | LPC1769.5 11.15,97.32 | 10.36,97.79 11.15,98.26 | LPC1769.5 11.15,98.26 | 10.36,97.79 11.15,97.32 | 10.36,97.79 11.15,98.26 | 10.36,97.79 11.15,97.32 | LPC1769.5 11.15,97.32 | 10.36,97.79 11.15,98.26 | LPC1769.5 11.15,98.26
MOTOROLA_ACK  (via drill 0.86 pad 1.52)
  Top 0.508: v46.23,73.66 29.21,73.66 28.45,72.9 v28.45,64.77
  Bottom 0.508: LPC1769.18 v28.45,64.77 | v46.23,73.66 46.23,69.34 46.99,68.58 JP2.25
MOTOROLA_D0
  Bottom 0.508: JP2.9 49.78,88.9 | 12.5,74.93 32,74.93 33.27,76.2 36.83,76.2 37.59,76.96 37.59,88.14 38.35,88.9 49.78,88.9 | 12.5,74.93 | 12.5,74.93 LPC1769.14 | 49.78,88.9 | 49.78,88.9 50.55,88.46 | JP2.9 50.55,88.46 | 49.78,88.9 | 49.78,88.9 50.55,89.34 | JP2.9 50.55,89.34 | 49.78,88.9 50.55,88.46 | 50.55,88.46 | JP2.9 50.55,88.46 | 49.78,88.9 50.55,89.34 | JP2.9 50.55,89.34 | 49.78,88.9 50.55,88.46 | JP2.9 50.55,88.46 | 49.78,88.9 50.55,89.34 | JP2.9 50.55,89.34 | 12.5,74.93 11.71,75.4 | LPC1769.14 11.71,75.4 | 12.5,74.93 | 12.5,74.93 11.71,74.46 | LPC1769.14 11.71,74.46 | 12.5,74.93 11.71,75.4 | 12.5,74.93 11.71,74.46 | 12.5,74.93 11.71,75.4 | LPC1769.14 11.71,75.4 | 12.5,74.93 11.71,74.46 | LPC1769.14 11.71,74.46
MOTOROLA_D1
  Bottom 0.508: JP2.10 52.62,88.18 | 52.62,88.18 52.07,87.63 39.12,87.63 38.35,86.87 38.35,74.42 37.59,73.66 9.65,73.66 8.89,74.42 8.89,79.25 9.65,80.01 10.36,80.01 | 10.36,80.01 | 10.36,80.01 LPC1769.12 | 52.62,88.18 53.47,88.41 JP2.10 | 52.62,88.18 52.85,89.03 JP2.10 | 10.36,80.01 | 10.36,80.01 11.15,79.54 | LPC1769.12 11.15,79.54 | 10.36,80.01 11.15,80.48 | LPC1769.12 11.15,80.48 | 10.36,80.01 11.15,79.54 | 10.36,80.01 11.15,80.48 | 10.36,80.01 11.15,79.54 | LPC1769.12 11.15,79.54 | 10.36,80.01 11.15,80.48 | LPC1769.12 11.15,80.48
MOTOROLA_D2
  Bottom 0.508: JP2.11 49.78,86.36 | 10.36,82.55 8.89,82.55 8.13,81.79 8.13,71.88 8.89,71.12 38.35,71.12 39.12,71.88 39.12,85.6 39.88,86.36 49.78,86.36 | 10.36,82.55 | 10.36,82.55 LPC1769.11 | 49.78,86.36 | 49.78,86.36 50.55,85.92 | JP2.11 50.55,85.92 | 49.78,86.36 | 49.78,86.36 50.55,86.8 | JP2.11 50.55,86.8 | 49.78,86.36 50.55,85.92 | 50.55,85.92 | JP2.11 50.55,85.92 | 49.78,86.36 50.55,86.8 | JP2.11 50.55,86.8 | 49.78,86.36 50.55,85.92 | JP2.11 50.55,85.92 | 49.78,86.36 50.55,86.8 | JP2.11 50.55,86.8 | 10.36,82.55 | 10.36,82.55 11.15,82.08 | LPC1769.11 11.15,82.08 | 10.36,82.55 11.15,83.02 | LPC1769.11 11.15,83.02 | 10.36,82.55 11.15,82.08 | 10.36,82.55 11.15,83.02 | 10.36,82.55 11.15,82.08 | LPC1769.11 11.15,82.08 | 10.36,82.55 11.15,83.02 | LPC1769.11 11.15,83.02
MOTOROLA_D3
  Bottom 0.508: JP2.12 52.62,85.64 | 52.62,85.64 52.07,85.09 40.64,85.09 39.88,84.33 39.88,69.34 39.12,68.58 30.99,68.58 30.23,67.82 30.23,51.82 29.46,51.05 13.97,51.05 12.95,50.04 12.95,45.21 13.61,44.55 | 13.61,44.55 13.72,44.45 LPC1769.57 | 52.62,85.64 53.47,85.87 JP2.12 | 52.62,85.64 52.85,86.49 JP2.12 | 13.61,44.55 14.31,44.05 LPC1769.57 | 13.61,44.55 14.4,44.91 LPC1769.57
MOTOROLA_D4
  Bottom 0.508: JP2.13 49.78,83.82 | 15.31,47.7 | 15.31,47.7 LPC1769.56 | 49.78,83.82 | 49.78,83.82 50.55,83.38 | JP2.13 50.55,83.38 | 49.78,83.82 | 49.78,83.82 50.55,84.26 | JP2.13 50.55,84.26 | 49.78,83.82 50.55,83.38 | 50.55,83.38 | JP2.13 50.55,83.38 | 49.78,83.82 50.55,84.26 | JP2.13 50.55,84.26 | 49.78,83.82 50.55,83.38 | JP2.13 50.55,83.38 | 49.78,83.82 50.55,84.26 | JP2.13 50.55,84.26 | 15.31,47.7 14.48,47.47 | 15.31,47.7 15.09,46.86 | 14.48,47.47 | LPC1769.56 14.48,47.47 | 15.31,47.7 15.09,46.86 | LPC1769.56 15.09,46.86 | 15.31,47.7 14.48,47.47 | LPC1769.56 14.48,47.47 | 15.31,47.7 15.09,46.86 | LPC1769.56 15.09,46.86 | 49.78,83.82 41.4,83.82 40.64,83.06 40.64,66.8 39.88,66.04 32,66.04 31.24,65.28 31.24,51.05 30.48,50.29 17.91,50.29 15.31,47.7
MOTOROLA_D5
  Bottom 0.508: JP2.14 52.62,83.1 | 52.62,83.1 52.07,82.55 42.16,82.55 41.4,81.79 41.4,66.04 40.64,65.28 39.12,65.28 38.35,64.52 38.35,40.89 37.59,40.13 6.35,40.13 5.59,40.89 5.59,51.31 6.35,52.07 LPC1769.23 | 52.62,83.1 53.47,83.33 JP2.14 | 52.62,83.1 52.85,83.95 JP2.14
MOTOROLA_D6
  Bottom 0.508: JP2.15 49.78,81.28 | LPC1769.24 11.43,49.78 12.05,50.4 | 12.05,50.4 13.21,51.56 13.21,52.58 12.45,53.34 5.59,53.34 4.83,52.58 4.83,40.13 5.59,39.37 38.35,39.37 39.12,40.13 39.12,64.01 39.62,64.52 41.4,64.52 42.16,65.28 42.16,80.52 42.93,81.28 49.78,81.28 | 49.78,81.28 | 49.78,81.28 50.55,80.84 | JP2.15 50.55,80.84 | 49.78,81.28 | 49.78,81.28 50.55,81.72 | JP2.15 50.55,81.72 | 49.78,81.28 50.55,80.84 | 50.55,80.84 | JP2.15 50.55,80.84 | 49.78,81.28 50.55,81.72 | JP2.15 50.55,81.72 | 49.78,81.28 50.55,80.84 | JP2.15 50.55,80.84 | 49.78,81.28 50.55,81.72 | JP2.15 50.55,81.72 | 12.05,50.4 11.21,50.03 LPC1769.24 | 12.05,50.4 11.97,49.49 LPC1769.24
MOTOROLA_D7  (via drill 0.86 pad 1.52)
  Top 0.508: v46.23,80.01 46.23,80.52 45.47,81.28 25.4,81.28 24.64,80.52 v24.64,72.39
  Bottom 0.508: JP2.16 53.09,81.28 52.51,80.7 | 52.51,80.7 51.79,79.98 46.25,79.98 v46.23,80.01 | 52.51,80.7 53.38,80.77 JP2.16 | 52.51,80.7 52.88,81.5 JP2.16 | v24.64,72.39 LPC1769.15
MOTOROLA_RW  (via drill 0.86 pad 1.52)
  Top 0.508: v27.18,67.31 27.18,75.44 27.94,76.2 v46.23,76.2
  Bottom 0.508: 49.78,76.2 JP2.19 | 49.78,76.2 | 49.78,76.2 50.55,75.76 | JP2.19 50.55,75.76 | 49.78,76.2 | 49.78,76.2 50.55,76.64 | JP2.19 50.55,76.64 | 49.78,76.2 50.55,75.76 | 50.55,75.76 | JP2.19 50.55,75.76 | 49.78,76.2 50.55,76.64 | JP2.19 50.55,76.64 | 49.78,76.2 50.55,75.76 | JP2.19 50.55,75.76 | 49.78,76.2 50.55,76.64 | JP2.19 50.55,76.64 | LPC1769.17 v27.18,67.31 | v46.23,76.2 49.78,76.2
MOTOROLA_STR  (via drill 0.86 pad 1.52)
  Top 0.508: v47.5,71.12 47.5,77.98 46.74,78.74 26.67,78.74 25.91,77.98 v25.91,69.85
  Bottom 0.508: 49.78,71.12 JP2.23 | 49.78,71.12 | 49.78,71.12 50.55,70.68 | JP2.23 50.55,70.68 | 49.78,71.12 v47.5,71.12 | 49.78,71.12 | 49.78,71.12 50.55,71.56 | JP2.23 50.55,71.56 | 50.55,70.68 | JP2.23 50.55,70.68 | 49.78,71.12 50.55,71.56 | JP2.23 50.55,71.56 | 49.78,71.12 50.55,70.68 | JP2.23 50.55,70.68 | 49.78,71.12 50.55,71.56 | JP2.23 50.55,71.56 | v25.91,69.85 LPC1769.16
N$1
  Bottom 0.508: U3.13 69.6,57.15 68.33,58.42 R8.2
N$3
  Bottom 0.508: U4.13 69.6,80.01 68.33,81.28 R12.2
N$4
  Bottom 0.508: U2.13 69.6,34.29 68.33,35.56 R4.2
N$7  (via drill 0.86 pad 1.52)
  Top 1.016: v68.58,108.2 68.58,106.68 67.56,105.66 42.93,105.66 41.91,106.68 41.91,113.28 40.64,114.55 24.13,114.55 23.11,113.54 v23.11,105.66
  Bottom 1.016: LPC1769.2 11.68,105.66 v23.11,105.66 | JP3.2 v68.58,108.2
N$8
  Bottom 0.508: U5.13 69.6,102.87 68.33,104.14 R16.2
N$9
  Bottom 0.508: U8.17 45.72,18.29 46.48,19.05 57.66,19.05 58.42,18.29 U8.12
N$13
  Bottom 0.508: U8.16 48.26,13.97 49.02,13.21 60.2,13.21 60.96,12.45 U8.10
N$14
  Bottom 0.508: U8.15 50.8,14.73 51.56,13.97 60.2,13.97 60.96,14.73 U8.11
N$15
  Bottom 0.508: U9.17 73.66,18.29 74.42,19.05 85.6,19.05 86.36,18.29 U9.12
N$16
  Bottom 0.508: U9.16 76.2,13.97 76.96,13.21 88.14,13.21 88.9,12.45 U9.10
N$17
  Bottom 0.508: U9.15 78.74,14.73 79.5,13.97 88.14,13.97 88.9,14.73 U9.11
PCF1_A0
  Bottom 0.508: JP1.6 63.5,31.75 62.23,33.02 R1.2 61.09,37.47 61.72,38.1 68.33,38.1 69.09,37.34 69.09,36.32 69.85,35.56 74.42,35.56 77.47,32.51 77.47,27.43 78.23,26.67 U2.1
PCF1_A1
  Bottom 0.508: U2.2 81.53,29.21 82.3,28.45 82.3,25.91 81.53,25.15 66.8,25.15 66.04,25.91 66.04,28.45 65.28,29.21 JP1.4 R2.2
PCF1_A2
  Bottom 0.508: U2.3 82.3,31.75 83.06,30.99 83.06,25.15 82.3,24.38 65.53,24.38 64.77,25.15 JP1.2 63.5,26.67 62.23,25.4 R3.2
PCF1_D0
  Bottom 0.508: U2.4 JP9.9
PCF1_D1
  Bottom 0.508: U2.5 JP9.7
PCF1_D2
  Bottom 0.508: U2.6 JP9.5
PCF1_D3
  Bottom 0.508: U2.7 JP9.3
PCF1_D4
  Bottom 0.508: U2.9 74.42,44.45 75.69,43.18 86.36,43.18 JP9.4
PCF1_D5
  Bottom 0.508: U2.10 74.42,41.91 75.69,40.64 86.36,40.64 JP9.6
PCF1_D6
  Bottom 0.508: U2.11 74.42,39.37 75.69,38.1 86.36,38.1 JP9.8
PCF1_D7
  Bottom 0.508: U2.12 74.42,36.83 75.69,35.56 86.36,35.56 JP9.10
PCF2_A0
  Bottom 0.508: JP5.6 63.5,54.61 62.23,55.88 R5.2 61.09,60.33 61.72,60.96 68.33,60.96 69.09,60.2 69.09,59.18 69.85,58.42 74.42,58.42 77.47,55.37 77.47,50.29 78.23,49.53 U3.1
PCF2_A1
  Bottom 0.508: R6.2 JP5.4 65.28,52.07 66.04,51.31 66.04,48.77 66.8,48.01 81.53,48.01 82.3,48.77 82.3,51.31 81.53,52.07 U3.2
PCF2_A2
  Bottom 0.508: R7.2 62.23,48.26 63.5,49.53 JP5.2 64.77,48.01 65.53,47.24 82.3,47.24 83.06,48.01 83.06,53.85 82.3,54.61 U3.3
PCF2_D0
  Bottom 0.508: U3.4 JP10.9
PCF2_D1
  Bottom 0.508: U3.5 JP10.7
PCF2_D2
  Bottom 0.508: U3.6 JP10.5
PCF2_D3
  Bottom 0.508: U3.7 JP10.3
PCF2_D4
  Bottom 0.508: U3.9 74.42,67.31 75.69,66.04 86.36,66.04 JP10.4
PCF2_D5
  Bottom 0.508: JP10.6 86.36,63.5 75.69,63.5 74.42,64.77 U3.10
PCF2_D6
  Bottom 0.508: U3.11 74.42,62.23 75.69,60.96 86.36,60.96 JP10.8
PCF2_D7
  Bottom 0.508: U3.12 74.42,59.69 75.69,58.42 86.36,58.42 JP10.10
PCF3_A0
  Bottom 0.508: JP7.6 63.5,77.47 62.23,78.74 R9.2 61.09,83.19 61.72,83.82 68.33,83.82 69.09,83.06 69.09,82.04 69.85,81.28 74.42,81.28 77.47,78.23 77.47,73.15 78.23,72.39 U4.1
PCF3_A1
  Bottom 0.508: R10.2 JP7.4 65.28,74.93 66.04,74.17 66.04,71.63 66.8,70.87 81.53,70.87 82.3,71.63 82.3,74.17 81.53,74.93 U4.2
PCF3_A2
  Bottom 0.508: R11.2 62.23,71.12 63.5,72.39 JP7.2 64.77,70.87 65.53,70.1 82.3,70.1 83.06,70.87 83.06,76.71 82.3,77.47 U4.3
PCF3_D0
  Bottom 0.508: U4.4 JP11.9
PCF3_D1
  Bottom 0.508: U4.5 JP11.7
PCF3_D2
  Bottom 0.508: U4.6 JP11.5
PCF3_D3
  Bottom 0.508: U4.7 JP11.3
PCF3_D4
  Bottom 0.508: U4.9 74.42,90.17 75.69,88.9 86.36,88.9 JP11.4
PCF3_D5
  Bottom 0.508: U4.10 74.42,87.63 75.69,86.36 86.36,86.36 JP11.6
PCF3_D6
  Bottom 0.508: U4.11 74.42,85.09 75.69,83.82 86.36,83.82 JP11.8
PCF3_D7
  Bottom 0.508: U4.12 74.42,82.55 75.69,81.28 86.36,81.28 JP11.10
PCF4_A0
  Bottom 0.508: JP8.6 63.5,100.33 62.23,101.6 R13.2 61.09,106.05 61.72,106.68 68.33,106.68 69.09,105.92 69.09,104.9 69.85,104.14 74.42,104.14 77.47,101.09 77.47,96.01 78.23,95.25 U5.1
PCF4_A1
  Bottom 0.508: R14.2 JP8.4 65.28,97.79 66.04,97.03 66.04,94.49 66.8,93.73 81.53,93.73 82.3,94.49 82.3,97.03 81.53,97.79 U5.2
PCF4_A2
  Bottom 0.508: R15.2 62.23,93.98 63.5,95.25 JP8.2 64.77,93.73 65.53,92.96 82.3,92.96 83.06,93.73 83.06,99.57 82.3,100.33 U5.3
PCF4_D0
  Bottom 0.508: U5.4 JP12.9
PCF4_D1
  Bottom 0.508: JP12.7 U5.5
PCF4_D2
  Bottom 0.508: U5.6 JP12.5
PCF4_D3
  Bottom 0.508: U5.7 JP12.3
PCF4_D4
  Bottom 0.508: U5.9 74.42,113.03 75.69,111.76 86.36,111.76 JP12.4
PCF4_D5
  Bottom 0.508: U5.10 74.42,110.49 75.69,109.22 86.36,109.22 JP12.6
PCF4_D6
  Bottom 0.508: U5.11 74.42,107.95 75.69,106.68 86.36,106.68 JP12.8
PCF4_D7
  Bottom 0.508: U5.12 74.42,105.41 75.69,104.14 86.36,104.14 JP12.10
RTS1  (via drill 0.86 pad 1.52)
  Top 0.508: v36.83,54.61 36.83,40.39 36.07,39.62 33.27,39.62 32.51,38.86 32.51,20.83 33.27,20.07 64.03,20.07 64.77,19.32 v64.77,12.19
  Bottom 0.508: LPC1769.49 v36.83,54.61 | v64.77,12.19 64.77,9.65 65.53,8.89 U9.1
RXD1  (via drill 0.86 pad 1.52)
  Top 0.508: v31.75,69.85 31.24,69.85 30.48,69.09 30.48,66.29 30.99,65.79 30.99,17.27 31.75,16.51 v36.07,16.51
  Bottom 0.508: LPC1769.43 v31.75,69.85 | v36.07,16.51 U8.20
RXD3  (via drill 0.86 pad 1.52)
  Top 0.508: v8.64,85.09 8.64,49.28 6.1,46.74 v6.1,33.53
  Bottom 0.508: LPC1769.10 v8.64,85.09 | v6.1,33.53 6.1,29.46 JP13.2
SCL0  (via drill 0.86 pad 1.52)
  Top 0.508: v74.93,100.33 v74.93,77.47 v74.93,54.61 v74.93,31.75 74.93,25.15 74.17,24.38 45.47,24.38 44.7,25.15 v44.7,32.77 | v7.37,44.45 7.37,33.53 8.13,32.77 v26.42,32.77
  Bottom 0.508: LPC1769.26 v7.37,44.45 | U2.14 v74.93,31.75 | v74.93,54.61 U3.14 | U4.14 v74.93,77.47 | U5.14 v74.93,100.33 | U1.6 45.47,45.72 44.7,44.96 v44.7,32.77 v26.42,32.77 26.42,24.38 25.65,23.62 7.11,23.62 6.35,22.86 JP4.2
SDA0  (via drill 0.86 pad 1.52)
  Top 0.508: v76.2,97.79 v76.2,74.93 v76.2,52.07 v76.2,29.21 76.2,24.38 75.44,23.62 43.94,23.62 43.18,24.38 v43.18,34.04 | v8.64,46.99 8.64,34.8 9.4,34.04 v24.89,34.04
  Bottom 0.508: LPC1769.25 v8.64,46.99 | U2.15 v76.2,29.21 | v76.2,52.07 U3.15 | U4.15 v76.2,74.93 | U5.15 v76.2,97.79 | U1.5 43.94,48.26 43.18,47.5 v43.18,34.04 v24.89,34.04 24.89,25.15 24.13,24.38 4.57,24.38 3.81,23.62 3.81,19.81 4.57,19.05 JP4.1
TXD1  (via drill 0.86 pad 1.52)
  Top 0.508: v31.75,72.39 30.48,72.39 29.72,71.63 29.72,65.79 30.23,65.28 30.23,16 30.99,15.24 35.31,15.24 36.07,14.48 v36.07,8.89
  Bottom 0.508: LPC1769.42 v31.75,72.39 | v36.07,8.89 U8.1
TXD3  (via drill 0.86 pad 1.52)
  Top 0.508: v7.37,87.63 7.37,49.78 4.83,47.24 v4.83,31.5
  Bottom 0.508: LPC1769.9 v7.37,87.63 | v4.83,31.5 4.57,31.5 3.81,30.73 3.81,27.43 4.57,26.67 JP13.1
USB_DM  (via drill 0.86 pad 1.52)
  Top 0.508: v55.88,102.62 40.13,102.62 39.37,103.38 39.37,111.51 38.61,112.27 26.67,112.27 25.91,111.51 v25.91,87.63
  Bottom 0.508: LPC1769.36 v25.91,87.63 | v55.88,102.62 U$2.D-
USB_DP  (via drill 0.86 pad 1.52)
  Top 0.508: v24.64,85.09 24.64,112.52 25.4,113.28 39.62,113.28 40.39,112.52 40.39,104.65 41.15,103.89 v53.34,103.89
  Bottom 0.508: v24.64,85.09 LPC1769.37 | v53.34,103.89 U$2.D+
(copper drawn outside any net)
  shapes: Top area x2, Top circle x2

### Text on the board
Top: GND | D3 | D4 | 1 | D0 | D7 | 1 | A0 | A1 | A2 | 1 | GND | GND | D3 | D4 | D0 | D7 | A0 | A1 | A2 | 1 | GND | GND | D3 | D4 | D0 | D7 | A0 | IPS-100 v2.1 / A.DAUPHINAIS | A1 | A2 | 1 | GND | GND | D3 | D4 | 1 | D0 | D7 | A0 | -> | RX | A1 | TX | <- | A2 | 1 | SCL | SDA | 1 | 1